# EAGLE design main (EAGLE 6.1)
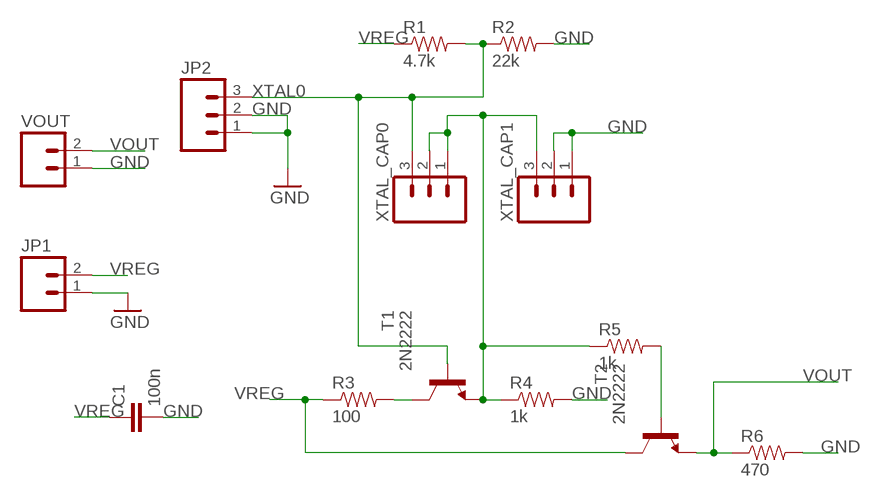
[diagram p0: schematic, sheet 1]

## Parts
C1  100n  CAPPTH  [CAP-PTH-SMALL]
JP1  M02LOCK  [1X02_LOCK]
JP2  M03LOCK  [1X03_LOCK]
R1  4.7k  RESISTORPTH-1/4W  [AXIAL-0.4]
R2  22k  RESISTORPTH-1/4W  [AXIAL-0.4]
R3  100  RESISTORPTH-1/4W  [AXIAL-0.4]
R4  1k  RESISTORPTH-1/4W  [AXIAL-0.4]
R5  1k  RESISTORPTH-1/4W  [AXIAL-0.4]
R6  470  RESISTORPTH-1/4W  [AXIAL-0.4]
T1  2N2222  [TO18]
T2  2N2222  [TO18]
VOUT  M02LOCK  [1X02_LOCK]
XTAL_CAP0  M03LOCK  [1X03_LOCK]
XTAL_CAP1  M03LOCK  [1X03_LOCK]

## Nets
GND: C1.2 JP1.1 JP2.1 JP2.2 R2.P$2 R4.P$2 R6.P$2 VOUT.1 XTAL_CAP1.1 XTAL_CAP1.2
N$1: R5.P$2 T2.2(B)
N$2: R3.P$2 T1.3(C)
N$8: R4.P$1 R5.P$1 T1.1(E) XTAL_CAP0.1 XTAL_CAP0.2 XTAL_CAP1.3
VOUT: R6.P$1 T2.1(E) VOUT.2
VREG: C1.1 JP1.2 R1.P$1 R3.P$1 T2.3(C)
XTAL0: JP2.3 R1.P$2 R2.P$1 T1.2(B) XTAL_CAP0.3

## Library data of the parts
C1 = SparkFun:CAP: Capacitor Standard 0603 ceramic capacitor, and 0.1" leaded capacitor.
JP1 VOUT = SparkFun:M02: Header 2 Standard 2-pin 0.1" header. Use with straight break away headers (SKU : PRT-00116), right angle break away headers (PRT-00553), swiss pins (PRT-00743), machine pins (PRT-00117), and female headers (PRT-00115). Molex polarized connector foot print use with SKU : PRT-08233 with associated crimp pins and housings.
JP2 XTAL_CAP0 XTAL_CAP1 = SparkFun:M03: Header 3 Standard 3-pin 0.1" header. Use with straight break away headers (SKU : PRT-00116), right angle break away headers (PRT-00553), swiss pins (PRT-00743), machine pins (PRT-00117), and female headers (PRT-00115). Molex polarized connector foot print use with SKU : PRT-08232 with associated crimp pins and housings.
R1-R6 = SparkFun:RESISTOR: Resistor Basic schematic elements and footprints for 0603, 1206, and PTH resistors.
T1 T2 = transistor:2N2222: NPN TRANSISTOR

## Board
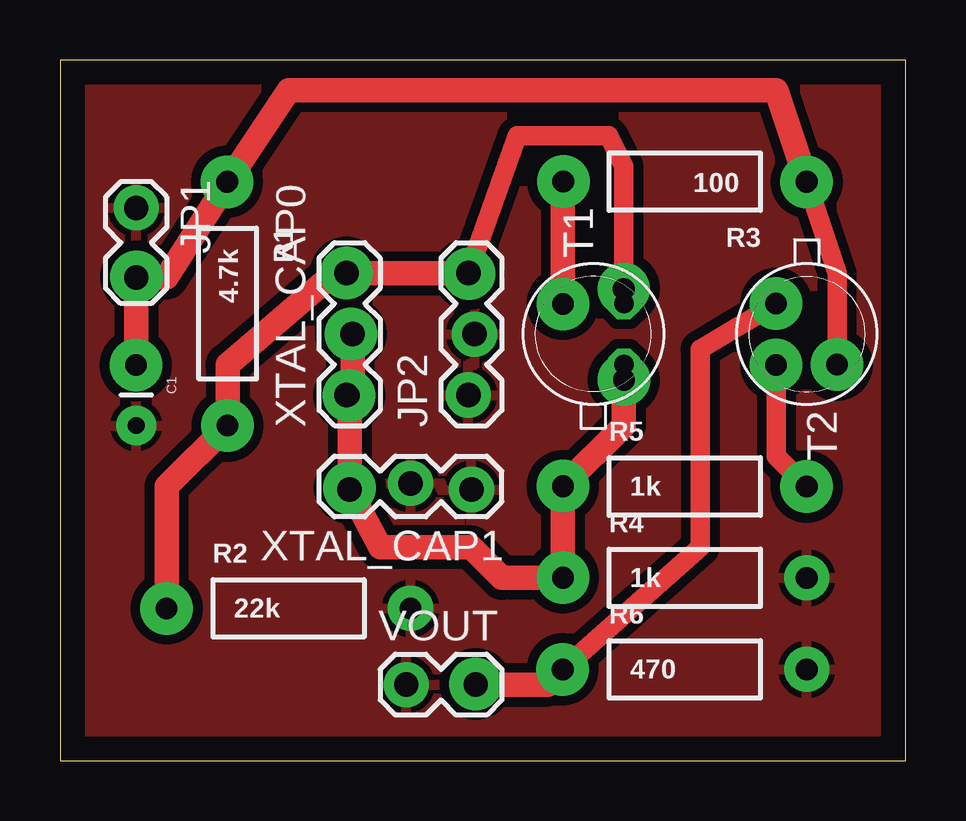
[diagram p1: board, top side]

Size 35.23 x 29.2 mm. Coordinates in mm from the lower left corner, seen from the top.
Outline: 0,0 35.23,0 35.23,29.2 0,29.2 0,0
Copper layers (1*16): Top 0.035mm / dielectric 1.5mm / Bottom 0.035mm
Design rules: minimum track width 10mil, minimum drill 24mil, track to track 8mil, track to pad 8mil, pad to pad 8mil, via to via 8mil, smd to smd 8mil, copper to edge 40mil, drill to drill 8mil, minimum pad ring 10mil, minimum via ring 8mil, stop-mask expansion 4mil, vias tented up to drill 0mil, thermal gap 10mil

### Footprints (pad centres in the part's own frame; a part is rotated, then mirrored left to right if it is on the bottom)
CAP-PTH-SMALL = drill 0.7 pad 1.651: 1 0,0; 2 2.54,0
1X02_LOCK = drill 1.016 pad 1.88: 1 -0.178,0; 2 2.718,0
1X03_LOCK = drill 1.016 pad 1.88: 1 0,0.127; 2 2.54,-0.127; 3 5.08,0.127
AXIAL-0.4 = drill 0.9 pad 1.88: P$1 -5.08,0; P$2 5.08,0
TO18 = drill 0.813 octagon: 1 -1.27,-1.27; 2 1.27,-1.27; 3 1.27,1.27

### Placement (x,y rotation side)
C1  3.17,16.51 270 top
JP1  3.17,22.86 270 top
JP2  17.14,15.24 90 top
R1  6.98,19.05 270 top
R2  9.53,6.35 0 top
R3  26.04,24.13 180 top
R4  26.04,7.62 0 top
R5  26.04,11.43 0 top
R6  26.04,3.81 0 top
T1  22.23,17.78 90 top
T2  31.12,17.78 270 top
VOUT  14.61,3.18 0 top
XTAL_CAP0  12.07,15.24 90 top
XTAL_CAP1  17.14,11.43 180 top

### Tracks (layer width: path | path; a pad name or v marks a point on that pad's centre or on a via)
GND
  pour Top (isolate 0.406): 0,29.21 34.92,29.21 34.92,0 0,0
N$1
  Top 0.813: T2.2 29.84,12.7 R5.P$2
N$2
  Top 1.016: R3.P$2 T1.3
N$3  (via drill 0.9 pad 2.18)
  other vias: 6.96,24.12
N$4  (via drill 0.9 pad 2.18)
  other vias: 20.97,24.13
N$5  (via drill 0.9 pad 2.18)
  other vias: 31.11,24.12
N$6  (via drill 0.9 pad 2.18)
  other vias: 3.18,20.17
N$7  (via drill 0.9 pad 2.18)
  other vias: 3.16,16.49
N$8
  Top 1.016: XTAL_CAP0.2 12.19,15.24 XTAL_CAP0.1 12.07,15.24 XTAL_CAP1.3 13.34,8.89 17.14,8.89 18.41,7.62 R4.P$1 R5.P$1 23.5,13.97 T1.1
N$9  (via drill 0.9 pad 2.18)
  other vias: 11.93,20.33
N$10  (via drill 0.9 pad 2.18)
  other vias: 17.04,20.3
N$11  (via drill 0.9 pad 2.18)
  other vias: 12.12,17.79
N$12  (via drill 0.9 pad 2.18)
  other vias: 12.04,15.22
N$13  (via drill 0.9 pad 2.18)
  other vias: 20.96,19.04
N$14  (via drill 0.9 pad 2.18)
  other vias: 23.49,19.66
N$15  (via drill 0.9 pad 2.18)
  other vias: 23.5,15.88
N$16  (via drill 0.9 pad 2.18)
  other vias: 29.84,19.05
N$17  (via drill 0.9 pad 2.18)
  other vias: 29.84,16.5
N$18  (via drill 0.9 pad 2.18)
  other vias: 32.37,16.5
N$19  (via drill 0.9 pad 2.18)
  other vias: 31.11,11.43
N$20  (via drill 0.9 pad 2.18)
  other vias: 12.07,11.37
N$21  (via drill 0.9 pad 2.18)
  other vias: 20.96,11.45
N$22  (via drill 0.9 pad 2.18)
  other vias: 20.96,7.64
N$23  (via drill 0.9 pad 2.18)
  other vias: 6.98,13.96
N$24  (via drill 0.9 pad 2.18)
  other vias: 4.45,6.35
N$25  (via drill 0.9 pad 2.18)
  other vias: 17.32,3.2
N$26  (via drill 0.9 pad 2.18)
  other vias: 20.94,3.81
VOUT
  Top 0.813: T2.1 26.67,17.14 26.67,8.89 R6.P$1
  Top 1.016: VOUT.2 20.32,3.18 R6.P$1
VREG
  Top 0.813: T2.3 32.38,20.32 R3.P$1
  Top 1.016: C1.1 JP1.2 4.45,20.14 R1.P$1 9.53,27.94 29.84,27.94 R3.P$1
XTAL0
  Top 0.813: JP2.3 19.05,26.04 22.86,26.04 23.5,24.77 T1.2
  Top 1.016: R2.P$1 4.45,11.43 R1.P$2 6.98,16.51 11.43,20.32 XTAL_CAP0.3 JP2.3